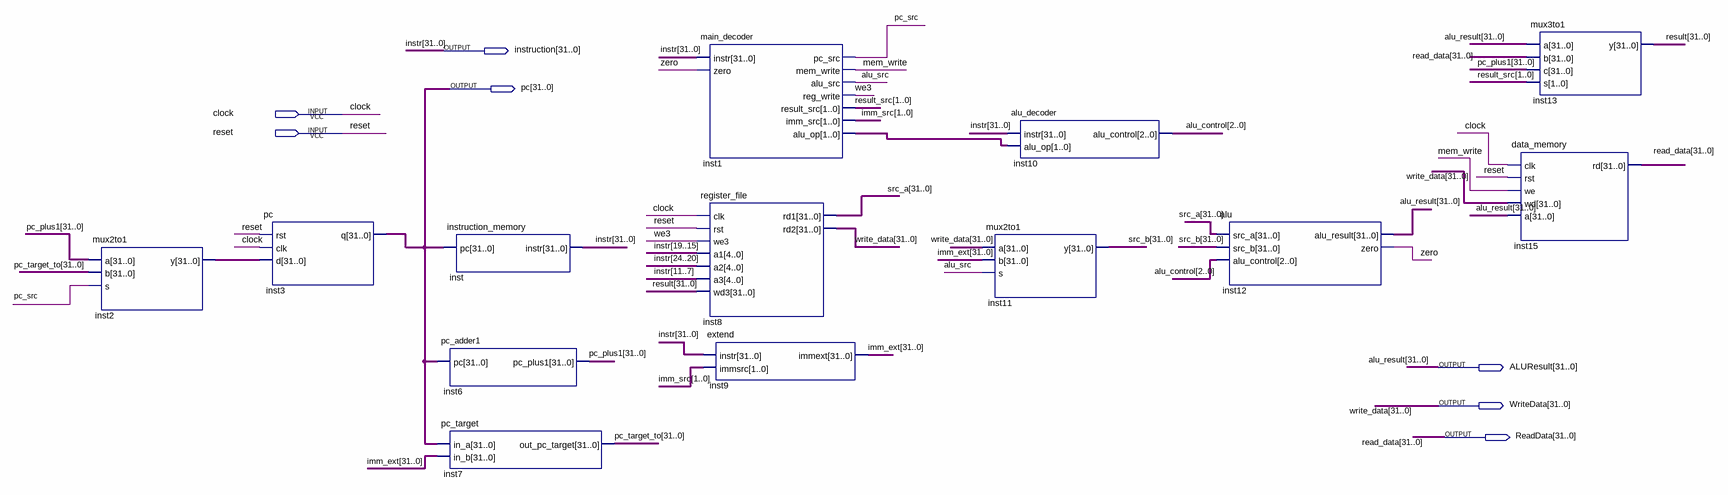
[diagram p0: schematic sheet]
// Quartus schematic riscv_rv32i_single_cycle.bdf as structural Verilog: 13 symbols, 7 pins
module riscv_rv32i_single_cycle (
  input  clock,
  input  reset,
  output [31:0] instruction,
  output [31:0] pc,
  output [31:0] ALUResult,
  output [31:0] WriteData,
  output [31:0] ReadData
);

  wire alu_src, mem_write, pc_src, we3, zero;
  wire [1:0] imm_src, inst1_alu_op, result_src;
  wire [2:0] alu_control;
  wire [31:0] imm_ext, inst2_y, pc_plus1, pc_target_to, result, src_a, src_b;

  mux2to1 inst2 (.a(pc_plus1), .b(pc_target_to), .s(pc_src), .y(inst2_y));
  pc inst3 (.rst(reset), .clk(clock), .d(inst2_y), .q(pc));
  instruction_memory inst (.pc(pc), .instr(instruction));
  pc_adder1 inst6 (.pc(pc), .pc_plus1(pc_plus1));
  pc_target inst7 (.in_a(pc), .in_b(imm_ext), .out_pc_target(pc_target_to));
  main_decoder inst1 (
    .instr(instruction), .zero(zero), .pc_src(pc_src), .mem_write(mem_write), .alu_src(alu_src),
    .reg_write(we3), .result_src(result_src), .imm_src(imm_src), .alu_op(inst1_alu_op));
  register_file inst8 (
    .clk(clock), .rst(reset), .we3(we3), .a1(instruction[19:15]), .a2(instruction[24:20]),
    .a3(instruction[11:7]), .wd3(result), .rd1(src_a), .rd2(WriteData));
  extend inst9 (.instr(instruction), .immsrc(imm_src), .immext(imm_ext));
  mux2to1 inst11 (.a(WriteData), .b(imm_ext), .s(alu_src), .y(src_b));
  alu_decoder inst10 (.instr(instruction), .alu_op(inst1_alu_op), .alu_control(alu_control));
  alu inst12 (.src_a(src_a), .src_b(src_b), .alu_control(alu_control), .alu_result(ALUResult), .zero(zero));
  mux3to1 inst13 (.a(ALUResult), .b(ReadData), .c(pc_plus1), .s(result_src), .y(result));
  data_memory inst15 (.clk(clock), .rst(reset), .we(mem_write), .wd(WriteData), .a(ALUResult), .rd(ReadData));

  // Other names for the same wires on the sheet: alu_result[31:0] = ALUResult; instr[31:0] = instruction;
  //   read_data[31:0] = ReadData; write_data[31:0] = WriteData
endmodule
